# EAGLE design rpi-radio (EAGLE 7.2.0)
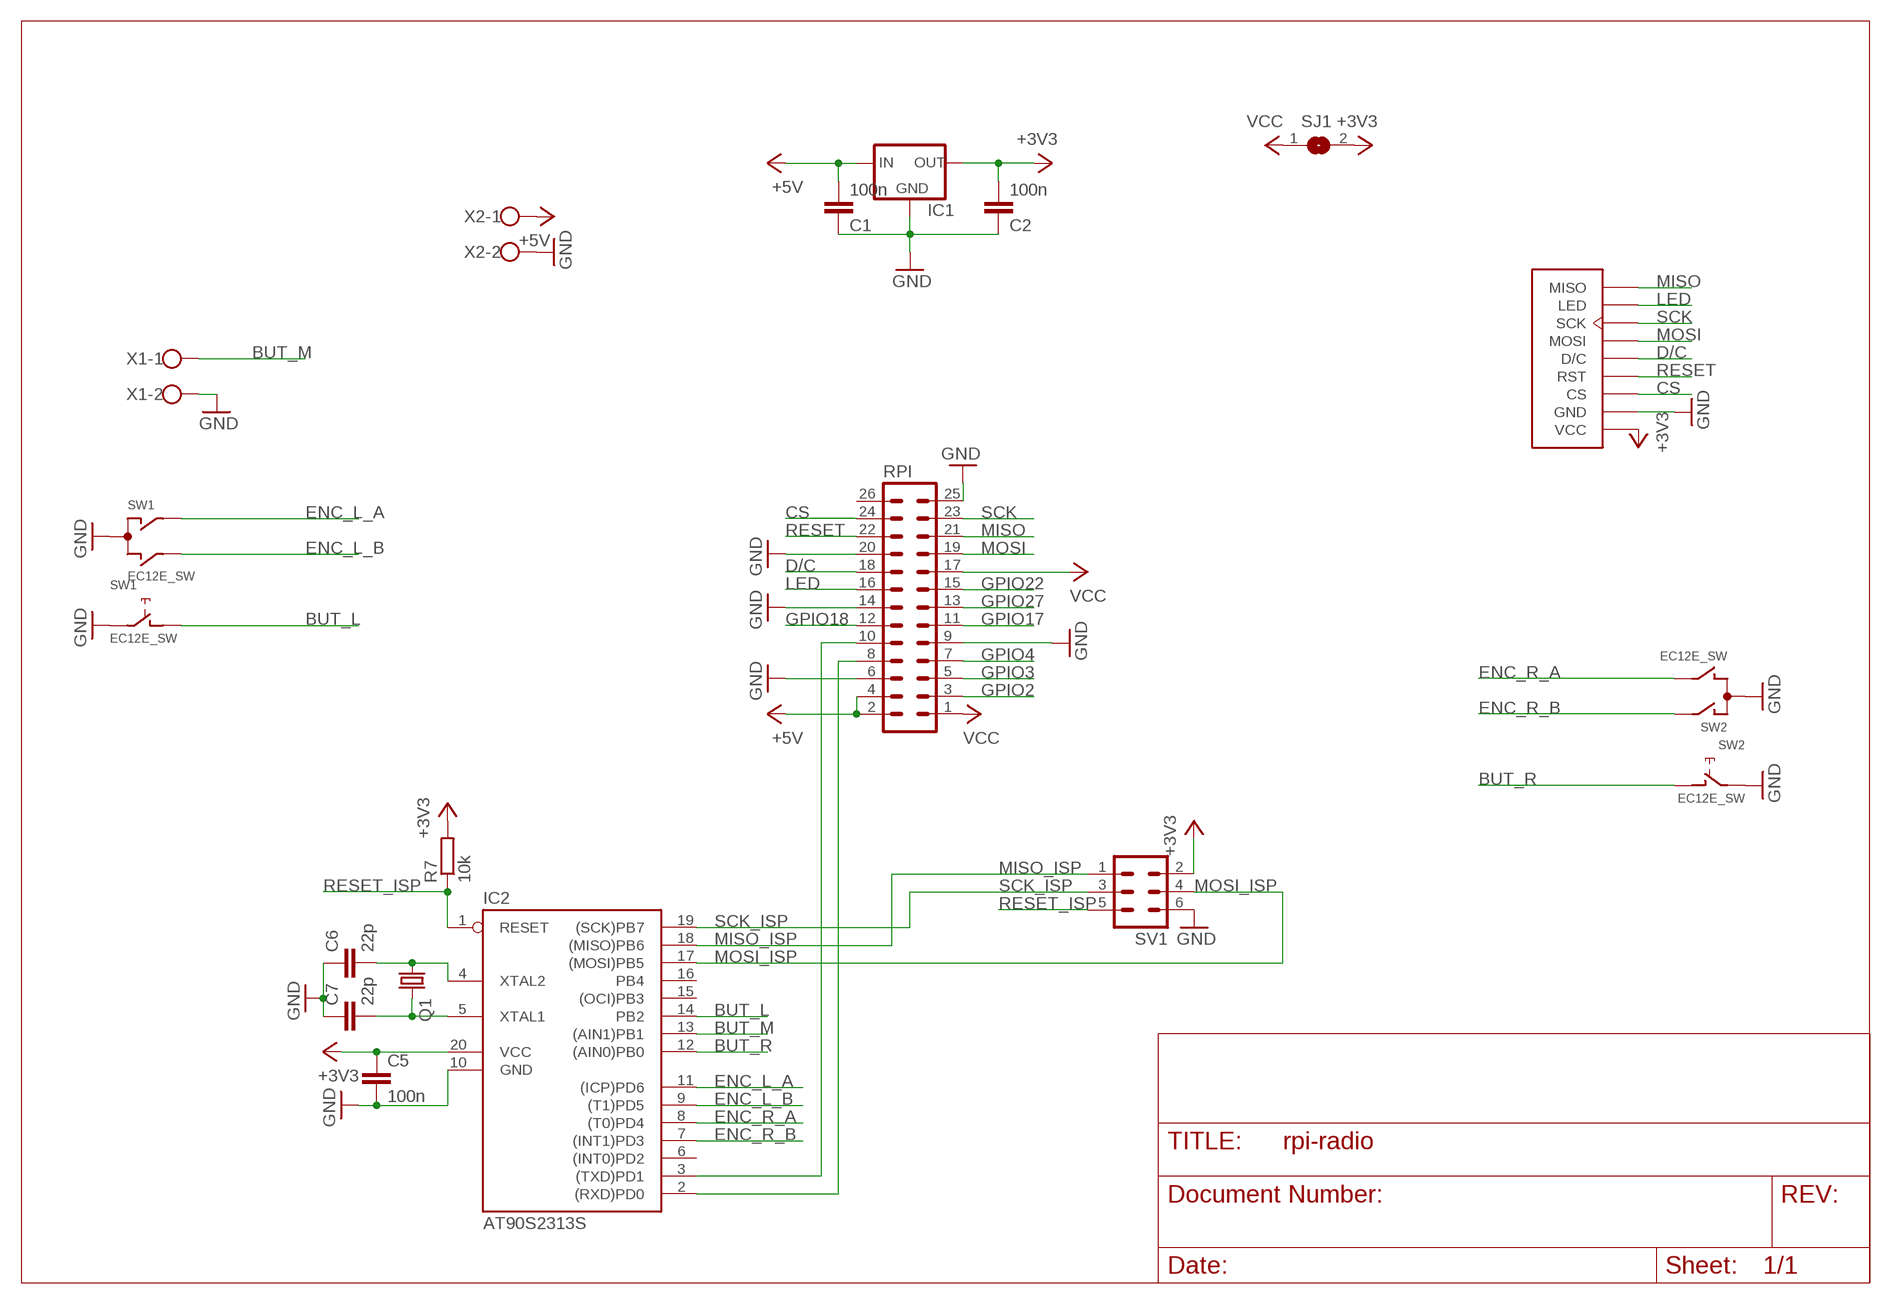
[diagram p0: schematic, sheet 1]

## Parts
C1  100n  C-EUC0805  [C0805]
C2  100n  C-EUC0805  [C0805]
C5  100n  C-EUC0805  [C0805]
C6  22p  C-EUC0805  [C0805]
C7  22p  C-EUC0805  [C0805]
IC1  78XXS  [78XXS]
IC2  AT90S2313S  [SO20L]
Q1  CRYSTALHC49S  [HC49/S]
R7  10k  R-EU_M0805  [M0805]
RPI  ML26  [ML26]
SJ1  SJ  [SJ]
SV1  ML6  [ML6]
SW1  EC12E_SW  [ALPS_EC12E_SW]
SW2  EC12E_SW  [ALPS_EC12E_SW]
U$4  DISPLAY  [DISPLAY]
X1  W237-102  [W237-102]
X2  W237-102  [W237-102]

## Nets
+3V3: C2.2 C5.1 IC1.OUT IC2.20(VCC) R7.2 SJ1.2 SV1.2 U$4.P$1(VCC)
+5V: C1.2 IC1.IN RPI.2 RPI.4 X2.1
BUT_L: IC2.14(PB2) SW1.D
BUT_M: IC2.13((AIN1)PB1) X1.1
BUT_R: IC2.12((AIN0)PB0) SW2.D
CS: RPI.24 U$4.P$3(CS)
D/C: RPI.18 U$4.P$5(D/C)
ENC_L_A: IC2.11((ICP)PD6) SW1.A
ENC_L_B: IC2.9((T1)PD5) SW1.B
ENC_R_A: IC2.8((T0)PD4) SW2.B
ENC_R_B: IC2.7((INT1)PD3) SW2.A
GND: C1.1 C2.1 C5.2 C6.1 C7.1 IC1.GND IC2.10(GND) RPI.6 RPI.9 RPI.14 RPI.20 RPI.25 SV1.6 SW1.C SW1.E SW2.C SW2.E U$4.P$2(GND) X1.2 X2.2
GPIO2: RPI.3
GPIO3: RPI.5
GPIO4: RPI.7
GPIO17: RPI.11
GPIO18: RPI.12
GPIO22: RPI.15
GPIO27: RPI.13
LED: RPI.16 U$4.P$8(LED)
MISO: RPI.21 U$4.P$9(MISO)
MISO_ISP: IC2.18((MISO)PB6) SV1.1
MOSI: RPI.19 U$4.P$6(MOSI)
MOSI_ISP: IC2.17((MOSI)PB5) SV1.4
N$10: C6.2 IC2.4(XTAL2) Q1.1
N$13: IC2.2((RXD)PD0) RPI.8
N$14: IC2.3((TXD)PD1) RPI.10
N$15: C7.2 IC2.5(XTAL1) Q1.2
RESET: RPI.22 U$4.P$4(RST)
RESET_ISP: IC2.1(RESET) R7.1 SV1.5
SCK: RPI.23 U$4.P$7(SCK)
SCK_ISP: IC2.19((SCK)PB7) SV1.3
VCC: RPI.1 RPI.17 SJ1.1
Unconnected: IC2.6((INT0)PD2) IC2.15((OCI)PB3) IC2.16(PB4) RPI.26 SW1.GND1(G) SW1.GND2(G) SW2.GND1(G) SW2.GND2(G)

## Library data of the parts
C1 C2 C5-C7 = resistor:C-EU: CAPACITOR, European symbol
IC1 = v-reg:78XXS: VOLTAGE REGULATOR
IC2 = atmel:AT90S2313: MICROCONTROLLER 2 Kbytes FLASH 128 bytes SRAM 128 bytes EEPROM UART; OC_FARNELL: unknown; OC_NEWARK: unknown
Q1 = crystal:CRYSTAL: CRYSTAL; OC_FARNELL: 1667008; OC_NEWARK: unknown
R7 = resistor:R-EU_: RESISTOR, European symbol
RPI = con-ml:ML26: HARTING; OC_FARNELL: unknown; OC_NEWARK: unknown
SJ1 = jumper:SJ: SMD solder JUMPER
SV1 = con-ml:ML6: HARTING; OC_FARNELL: unknown; OC_NEWARK: unknown
SW1 SW2 = rpi-radio:EC12E_SW: ALPS rotary Encoder EC12E series with switch; MPN: EC12E2424407; OC_FARNELL: 1520813; OC_NEWARK: 74M1068
U$4 = display:DISPLAY
X1 X2 = con-wago-500:W237-102: WAGO SCREW CLAMP; MPN: 237-102; OC_FARNELL: unknown; OC_NEWARK: 70K9898

## Board
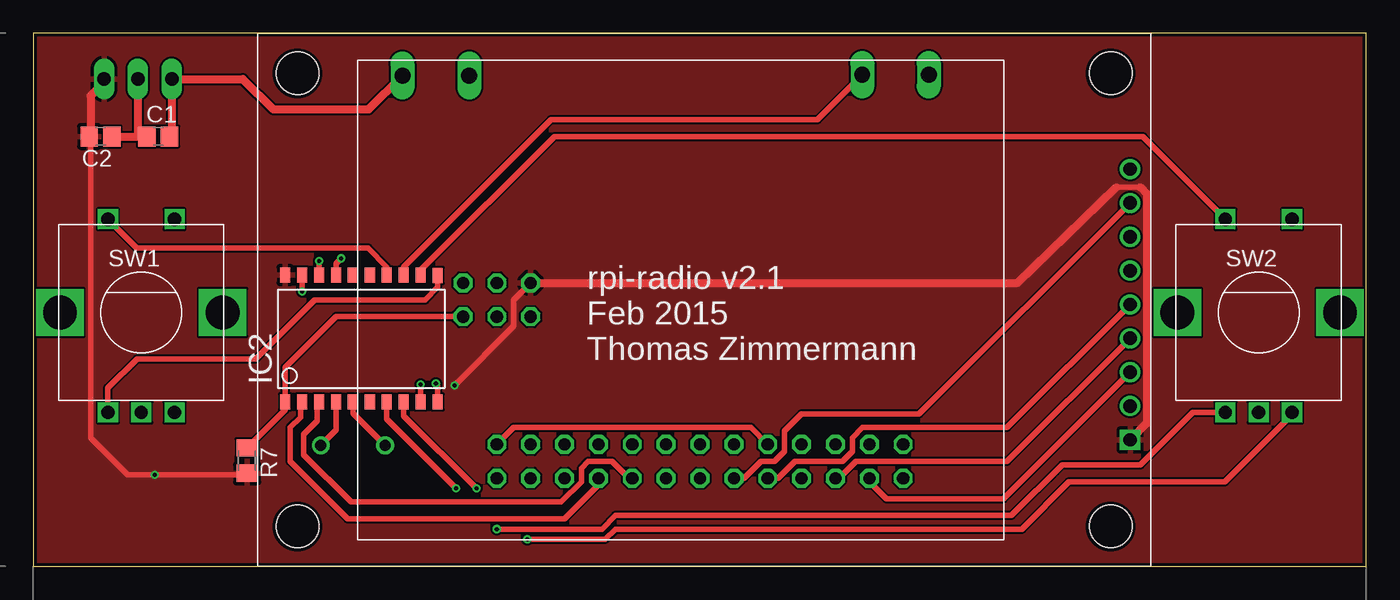
[diagram p1: board, top side]
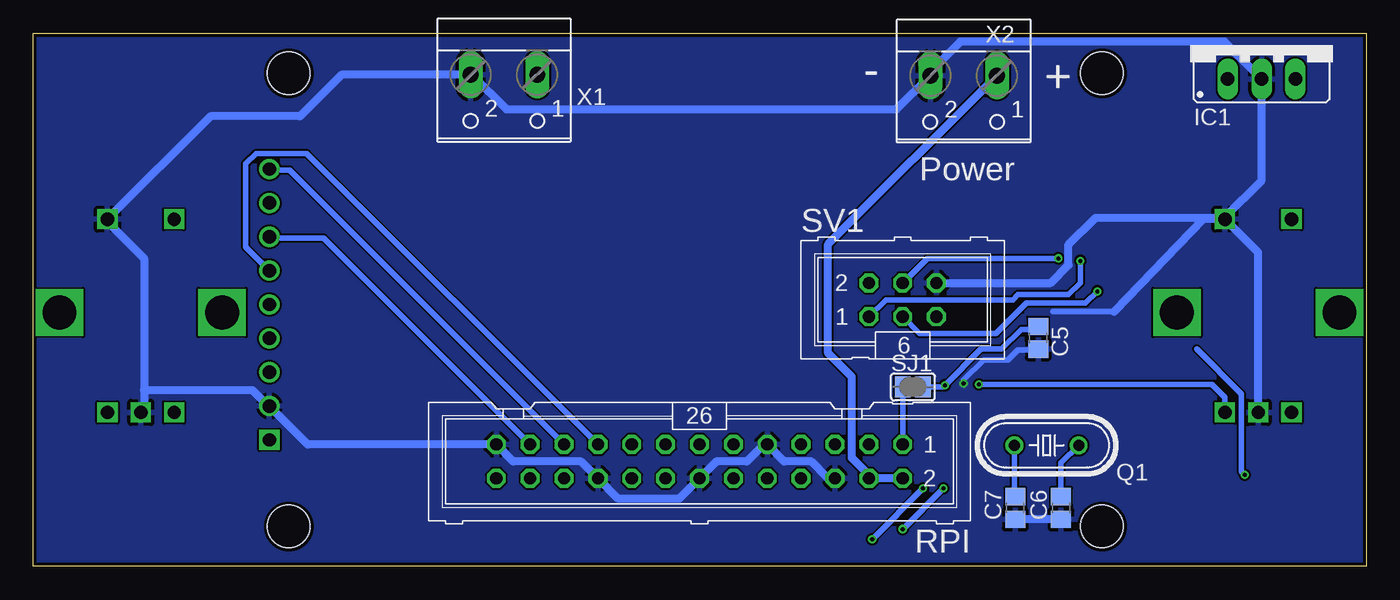
[diagram p2: board, bottom side, seen from below]

Size 99.98 x 40 mm. Coordinates in mm from the lower left corner, seen from the top.
Outline: 0,0 99.98,0 99.98,40 0,40 0,0
Copper layers (1*16): Top 0.035mm / dielectric 1.5mm / Bottom 0.035mm
Design rules "Elecrow_2-layer_eagle_rule": minimum track width 6mil, minimum drill 12mil, track to track 6mil, track to pad 6mil, pad to pad 6mil, via to via 6mil, smd to smd 0mil, copper to edge 10mil, drill to drill 10mil, minimum pad ring 10mil, minimum via ring 6mil, stop-mask expansion 2mil, vias tented up to drill 100mil, thermal gap 10mil

### Footprints (pad centres in the part's own frame; a part is rotated, then mirrored left to right if it is on the bottom)
C0805 = smd 1.3 x 1.5: 1 -0.85,0; 2 0.85,0
78XXS = drill 1.016 long: GND 0,-2.54; IN -2.54,-2.54; OUT 2.54,-2.54
SO20L = smd 0.762 x 1.143: 1 -5.08,-5.131; 2 -3.81,-5.131; 3 -2.54,-5.131; 4 -1.27,-5.131; 5 0,-5.131; 6 1.27,-5.131; 7 2.54,-5.131; 8 3.81,-5.131; 9 5.08,-5.131; 10 6.35,-5.131; 11 6.35,4.369; 12 5.08,4.394; 13 3.81,4.394; 14 2.54,4.394; 15 1.27,4.394; 16 0,4.394; 17 -1.27,4.394; 18 -2.54,4.394; 19 -3.81,4.394; 20 -5.08,4.394
HC49/S = drill 0.813: 1 -2.413,0; 2 2.413,0
M0805 = smd 1.3 x 1.6: 1 -0.95,0; 2 0.95,0
ML26 = drill 0.914 octagon: 1 -15.24,-1.27; 2 -15.24,1.27; 3 -12.7,-1.27; 4 -12.7,1.27; 5 -10.16,-1.27; 6 -10.16,1.27; 7 -7.62,-1.27; 8 -7.62,1.27; 9 -5.08,-1.27; 10 -5.08,1.27; 11 -2.54,-1.27; 12 -2.54,1.27; 13 0,-1.27; 14 0,1.27; 15 2.54,-1.27; 16 2.54,1.27; 17 5.08,-1.27; 18 5.08,1.27; 19 7.62,-1.27; 20 7.62,1.27; 21 10.16,-1.27; 22 10.16,1.27; 23 12.7,-1.27; 24 12.7,1.27; 25 15.24,-1.27; 26 15.24,1.27
SJ = smd 1.168 x 1.6: 1 -0.762,0; 2 0.762,0
ML6 = drill 0.914 octagon: 1 -2.54,-1.27; 2 -2.54,1.27; 3 0,-1.27; 4 0,1.27; 5 2.54,-1.27; 6 2.54,1.27
ALPS_EC12E_SW = drill 1 square: A -2.5,-7.5; B 2.5,-7.5; C 0,-7.5; D -2.5,7; E 2.5,7 | drill 2.54 square: GND1 -6.1,0; GND2 6.1,0
DISPLAY = drill 1 square: P$1 68.46,9.49 | drill 1: P$2 68.46,12.03; P$3 68.46,14.57; P$4 68.46,17.11; P$5 68.46,19.65; P$6 68.46,22.19; P$7 68.46,24.73; P$8 68.46,27.27; P$9 68.46,29.81 | hole 3.2: 6,37; 6,3; 67,3; 67,37
W237-102 = drill 1.194 long: 1 -2.5,-1.27; 2 2.5,-1.27

### Placement (x,y rotation side)
C1  9.37,32.26 0 top
C2  5.05,32.26 180 top
C5  24.61,17.14 270 bottom
C6  22.89,4.38 90 bottom
C7  26.32,4.38 90 bottom
IC1  7.84,39.12 0 bottom
IC2  23.97,17.46 0 top
Q1  23.97,9.08 180 bottom
R7  16.03,7.94 270 top
RPI  50.01,7.87 180 bottom
SJ1  34,13.46 0 bottom
SV1  34.77,20 0 bottom
SW1  8.1,19.05 0 top
SW2  91.92,19.05 0 top
U$4  13.81,0 0 top
X1  64.67,35.62 180 bottom
X2  30.19,35.56 180 bottom

### Tracks (layer width: path | path; a pad name or v marks a point on that pad's centre or on a via)
+3V3  (via drill 0.3)
  Top 0.406: v31.59,13.59 36.04,18.03 36.04,20 SV1.2 | 81.25,28.45 83.03,28.45 | 4.29,32.35 4.29,9.65 7.08,6.86 v9.11,6.86 15.9,6.86 R7.2
  Top 0.61: IC1.OUT 5.3,36.32 4.29,35.31 4.29,32.35 C2.2 | SV1.2 73.82,21.27 81.25,28.45 | 83.03,28.45 83.53,27.94 83.53,10.75 U$4.P$1
  Bottom 0.406: SJ1.2 31.72,13.46 v31.59,13.59 28.89,16.29 27.36,16.29 25.88,17.78 24.82,17.78 C5.1 | 12.71,16.29 9.37,12.95 9.37,7.11 v9.11,6.86
  pour Top: -0.13,40.02 -0.29,0 100.81,0 100.71,40.27
+5V
  Top 0.61: C1.2 10.38,32.42 IC1.IN 15.72,36.58 18,34.29 25.15,34.29 X2.1
  Bottom 0.61: RPI.4 RPI.2 37.05,6.6 38.58,8.13 38.58,14.22 40.35,16 40.35,24.17 X2.1
BUT_L
  Top 0.406: IC2.14 26.51,22.48 25.11,23.88 7.77,23.88 SW1.D
BUT_M
  Top 0.406: IC2.13 27.78,22.48 38.83,33.53 58.81,33.53 X1.1
BUT_R
  Top 0.406: IC2.12 29.05,22.22 39.08,32.26 83.21,32.26 SW2.D
CS
  Top 0.406: RPI.24 62.71,6.35 63.98,5.08 72.78,5.08 U$4.P$3
D/C
  Top 0.406: RPI.18 55.85,6.6 57.12,7.87 60.67,7.87 61.44,8.64 61.44,9.65 62.2,10.41 73.03,10.41 U$4.P$5
ENC_L_A
  Top 0.4: SW1.A 5.6,13.37 7.78,15.56 16.67,15.56 21.11,20 29.37,20 30.32,20.96 IC2.11
ENC_L_B  (via drill 0.3)
  Top 0.4: v29.05,13.65 IC2.9
  Bottom 0.4: SW1.B 10.6,12.66 11.59,13.65 v29.05,13.65
ENC_R_A  (via drill 0.3)
  Top 0.406: SW2.B 94.42,11.39 89.38,6.35 77.69,6.35 74.14,2.79 43.66,2.79 42.89,2.03 v37.05,2.03 | IC2.8 27.78,11.3 v33.24,5.84
  Bottom 0.406: v33.24,5.84 v37.05,2.03
ENC_R_B  (via drill 0.3)
  Top 0.406: SW2.A 86.96,11.55 83.03,7.62 77.18,7.62 73.37,3.81 43.66,3.81 42.64,2.79 v34.77,2.79 | IC2.7 26.51,11.05 v31.72,5.84
  Bottom 0.406: v31.72,5.84 v34.77,2.79
GND  (via drill 0.3)
  Top 0.406: IC2.10 30.32,13.59 v30.19,13.72
  Top 0.61: C2.1 7.84,32.26 | 7.84,32.26 C1.1 | IC1.GND 7.84,32.26
  Bottom 0.4: 18.89,19.11 23.49,19.11
  Bottom 0.406: v30.19,13.72 30.19,13.97 28.67,15.49 26.89,15.49 26.13,16.26 24.64,16.26 C5.2
  Bottom 0.61: SW1.E 10.6,26.2 7.84,28.96 IC1.GND 10.64,39.37 30.45,39.37 32.69,37.12 X2.2 35.23,34.29 64.48,34.29 67.09,36.89 X1.2 76.87,36.89 79.98,33.78 86.68,33.78 SW2.E 94.42,25.87 91.66,23.11 91.66,13.21 | SW1.C 8.1,23.55 SW1.E | 91.66,13.21 91.66,11.8 SW2.C | RPI.6 40.35,6.6 41.62,7.87 43.66,7.87 RPI.9 45.18,9.14 46.45,7.87 48.74,7.87 RPI.14 51.53,5.08 56.1,5.08 RPI.20 58.9,7.87 63.98,7.87 RPI.25 79.38,9.14 U$4.P$2 82.36,12.03 83.53,13.21 91.66,13.21 | SW1.E 12.21,26.05 18.89,19.11 | SV1.6 23.65,21.27 22.32,22.61 22.32,24.13 20.29,26.16 10.71,26.16 SW1.E | C6.1 C7.1
  pour Bottom: -2.06,40.27 100.81,40.27 100.81,0 -2.06,0
LED
  Top 0.406: RPI.16 53.31,6.6 54.58,7.87 55.59,7.87 56.36,8.64 56.36,10.16 57.63,11.43 66.43,11.43 U$4.P$8
MISO
  Bottom 0.406: RPI.21 80.74,29.72 82.18,29.72 U$4.P$9
MISO_ISP  (via drill 0.3)
  Top 0.4: v21.43,22.92 IC2.18
  Bottom 0.4: SV1.1 36.04,20 26.51,20 26.13,20.38 22.32,20.38 21.43,21.27 v21.43,22.92
MOSI
  Bottom 0.406: RPI.19 79.47,30.99 83.28,30.99 84.04,30.23 84.04,23.96 U$4.P$6
MOSI_ISP  (via drill 0.3)
  Top 0.406: IC2.17 22.7,22.73 v23.08,23.11
  Bottom 0.406: v23.08,23.11 32.92,23.11 SV1.4
N$10
  Top 0.406: IC2.4 22.7,10.22 Q1.1
  Bottom 0.406: C6.2 22.89,7.75 Q1.1
N$13
  Top 0.406: RPI.8 42.39,6.1 39.85,3.56 23.59,3.56 19.27,7.87 19.27,10.41 20.03,11.18 20.03,12.21 IC2.2
N$14
  Top 0.406: RPI.10 44.67,6.6 43.4,7.87 41.62,7.87 41.12,7.37 41.12,6.35 39.59,4.83 23.84,4.83 20.29,8.38 20.29,9.91 21.3,10.92 21.3,12.21 IC2.3 21.56,12.21
N$15
  Top 0.406: IC2.5 23.97,11.49 Q1.2
  Bottom 0.406: Q1.2 26.38,5.29 C7.2
RESET
  Top 0.406: RPI.22 60.42,6.6 61.69,7.87 73.03,7.87 U$4.P$4
RESET_ISP
  Top 0.4: R7.1 18.89,11.75 IC2.1 18.89,14.92 22.7,18.73 SV1.5
SCK
  Bottom 0.406: RPI.23 78.2,24.64 82.18,24.64 U$4.P$7
SCK_ISP  (via drill 0.3)
  Top 0.4: v20.16,20.64 IC2.19
  Bottom 0.4: SV1.3 33.5,17.46 27.78,17.46 25.5,19.75 21.05,19.75 v20.16,20.64
VCC
  Top 0.406: RPI.17 53.82,10.41 36.04,10.41 RPI.1
  Bottom 0.406: SJ1.1 RPI.1

### Text on the board
tNames: rpi-radio v2.1 / Feb 2015 / Thomas Zimmermann
bNames: + | - | Power